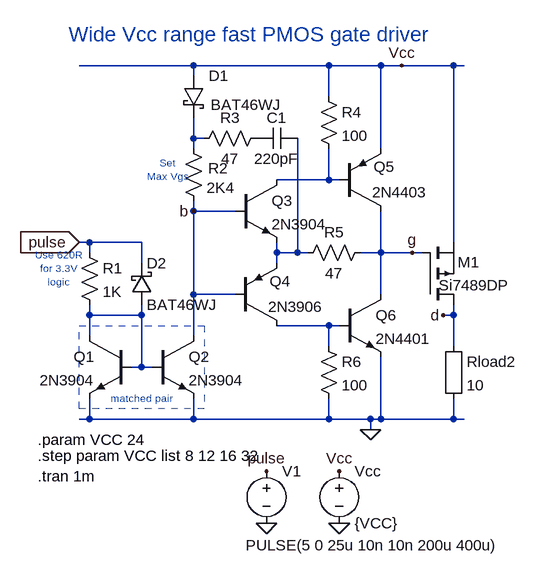
[diagram p0: schematic FastMos4.asc]
FastMos4.asc, the LTspice schematic file:
Version 4
SHEET 1 1312 680
WIRE 224 -192 48 -192
WIRE 432 -192 224 -192
WIRE 512 -192 432 -192
WIRE 544 -192 512 -192
WIRE 624 -192 544 -192
WIRE 640 -192 624 -192
WIRE 224 -176 224 -192
WIRE 432 -144 432 -192
WIRE 224 -80 224 -112
WIRE 240 -80 224 -80
WIRE 224 -64 224 -80
WIRE 512 -64 512 -192
WIRE 432 -16 432 -64
WIRE 432 -16 352 -16
WIRE 448 -16 432 -16
WIRE 224 32 224 16
WIRE 288 32 224 32
WIRE 64 80 48 80
WIRE 144 80 64 80
WIRE 624 80 624 -192
WIRE 64 96 64 80
WIRE 352 96 352 80
WIRE 384 96 384 -80
WIRE 384 96 352 96
WIRE 400 96 384 96
WIRE 512 96 512 32
WIRE 512 96 480 96
WIRE 560 96 512 96
WIRE 576 96 560 96
WIRE 144 112 144 80
WIRE 352 112 352 96
WIRE 224 160 224 32
WIRE 288 160 224 160
WIRE 512 160 512 96
WIRE 64 192 64 176
WIRE 144 192 144 176
WIRE 144 192 64 192
WIRE 624 192 624 176
WIRE 624 192 608 192
WIRE 432 208 352 208
WIRE 448 208 432 208
WIRE 64 224 64 192
WIRE 224 224 224 160
WIRE 432 240 432 208
WIRE 624 240 624 192
WIRE 144 272 144 192
WIRE 144 272 128 272
WIRE 160 272 144 272
WIRE 64 352 64 320
WIRE 64 352 48 352
WIRE 224 352 224 320
WIRE 224 352 64 352
WIRE 432 352 432 320
WIRE 432 352 224 352
WIRE 496 352 432 352
WIRE 512 352 512 256
WIRE 512 352 496 352
WIRE 624 352 624 320
WIRE 624 352 512 352
WIRE 640 352 624 352
WIRE 496 368 496 352
FLAG 496 368 0
FLAG 544 -192 Vcc
FLAG 448 432 Vcc
FLAG 336 432 pulse
FLAG 48 80 pulse
IOPIN 48 80 In
FLAG 560 96 g
FLAG 608 192 d
FLAG 336 512 0
FLAG 448 512 0
FLAG 224 32 b
SYMBOL npn 288 -16 R0
SYMATTR InstName Q3
SYMATTR Value 2N3904
SYMBOL res 208 -80 R0
WINDOW 0 38 46 Left 2
SYMATTR InstName R2
SYMATTR Value 2K4
SYMBOL voltage 336 416 R0
WINDOW 123 0 0 Left 2
WINDOW 39 0 0 Left 2
WINDOW 3 -32 130 Left 2
SYMATTR Value PULSE(5 0 25u 10n 10n 200u 400u)
SYMATTR InstName V1
SYMBOL voltage 448 416 R0
WINDOW 123 0 0 Left 2
WINDOW 39 0 0 Left 2
SYMATTR InstName Vcc
SYMATTR Value {VCC}
SYMBOL pmos 576 176 M180
WINDOW 0 54 65 Left 2
WINDOW 3 25 30 Left 2
SYMATTR InstName M1
SYMATTR Value Si7489DP
SYMBOL pnp 288 208 M180
WINDOW 0 53 68 Left 2
WINDOW 3 51 29 Left 2
SYMATTR InstName Q4
SYMATTR Value 2N3906
SYMBOL res 48 80 R0
SYMATTR InstName R1
SYMATTR Value 1K
SYMBOL Misc\\EuropeanResistor 608 224 R0
SYMATTR InstName Rload2
SYMATTR Value 10
SYMBOL npn 160 224 R0
SYMATTR InstName Q2
SYMATTR Value 2N3904
SYMBOL cap 320 -64 R270
WINDOW 0 32 32 VTop 2
WINDOW 3 0 32 VBottom 2
SYMATTR InstName C1
SYMATTR Value 220pF
SYMBOL schottky 208 -176 R0
WINDOW 0 39 0 Left 2
WINDOW 3 42 44 Left 2
SYMATTR InstName D1
SYMATTR Value BAT46WJ
SYMATTR Description Diode
SYMATTR Type diode
SYMBOL npn 128 224 M0
SYMATTR InstName Q1
SYMATTR Value 2N3904
SYMBOL schottky 128 176 M180
WINDOW 0 24 64 Left 2
WINDOW 3 24 0 Left 2
SYMATTR InstName D2
SYMATTR Value BAT46WJ
SYMATTR Description Diode
SYMATTR Type diode
SYMBOL res 496 80 R90
WINDOW 0 0 56 VBottom 2
WINDOW 3 32 56 VTop 2
SYMATTR InstName R5
SYMATTR Value 47
SYMBOL npn 448 160 R0
SYMATTR InstName Q6
SYMATTR Value 2N4401
SYMBOL pnp 448 32 M180
WINDOW 0 53 68 Left 2
WINDOW 3 51 29 Left 2
SYMATTR InstName Q5
SYMATTR Value 2N4403
SYMBOL res 416 -160 R0
SYMATTR InstName R4
SYMATTR Value 100
SYMBOL res 416 224 R0
SYMATTR InstName R6
SYMATTR Value 100
SYMBOL res 224 -64 R270
WINDOW 0 32 56 VTop 2
WINDOW 3 0 56 VBottom 2
SYMATTR InstName R3
SYMATTR Value 47
TEXT 32 -240 Left 3 ;Wide Vcc range fast PMOS gate driver
TEXT -16 440 Left 2 !.tran 1m
TEXT 184 -32 Center 1 ;Set\nMax Vgs
TEXT -16 408 Left 2 !.step param VCC list 8 12 16 32
TEXT 96 320 Left 1 ;matched pair
TEXT -16 384 Left 2 !.param VCC 24
TEXT 16 120 Center 1 ;Use 620R\nfor 3.3V\nlogic
RECTANGLE Normal 240 336 48 208 2

The netlist it stands for:
* FastMos4.asc
Q3 N002 b N003 0 2N3904
R2 N001 b 2K4
V1 pulse 0 PULSE(5 0 25u 10n 10n 200u 400u)
Vcc Vcc 0 {VCC}
M1 d g Vcc Vcc Si7489DP
Q4 N005 b N003 0 2N3906
R1 pulse N004 1K
Rload2 d 0 10
Q2 b N004 0 0 2N3904
C1 P001 N003 220pF
D1 Vcc N001 BAT46WJ
Q1 N004 N004 0 0 2N3904
D2 N004 pulse BAT46WJ
R5 g N003 47
Q6 g N005 0 0 2N4401
Q5 g N002 Vcc 0 2N4403
R4 Vcc N002 100
R6 N005 0 100
R3 N001 P001 47
.model D D
.lib standard.dio
.model NPN NPN
.model PNP PNP
.lib standard.bjt
.model NMOS NMOS
.model PMOS PMOS
.lib standard.mos
* Wide Vcc range fast PMOS gate driver
.tran 1m
* Set
* Max Vgs
.step param VCC list 8 12 16 32
* matched pair
.param VCC 24
* Use 620R
* for 3.3V
* logic
.backanno
.end